# EAGLE design Mood-Badge (EAGLE 9.6.2)
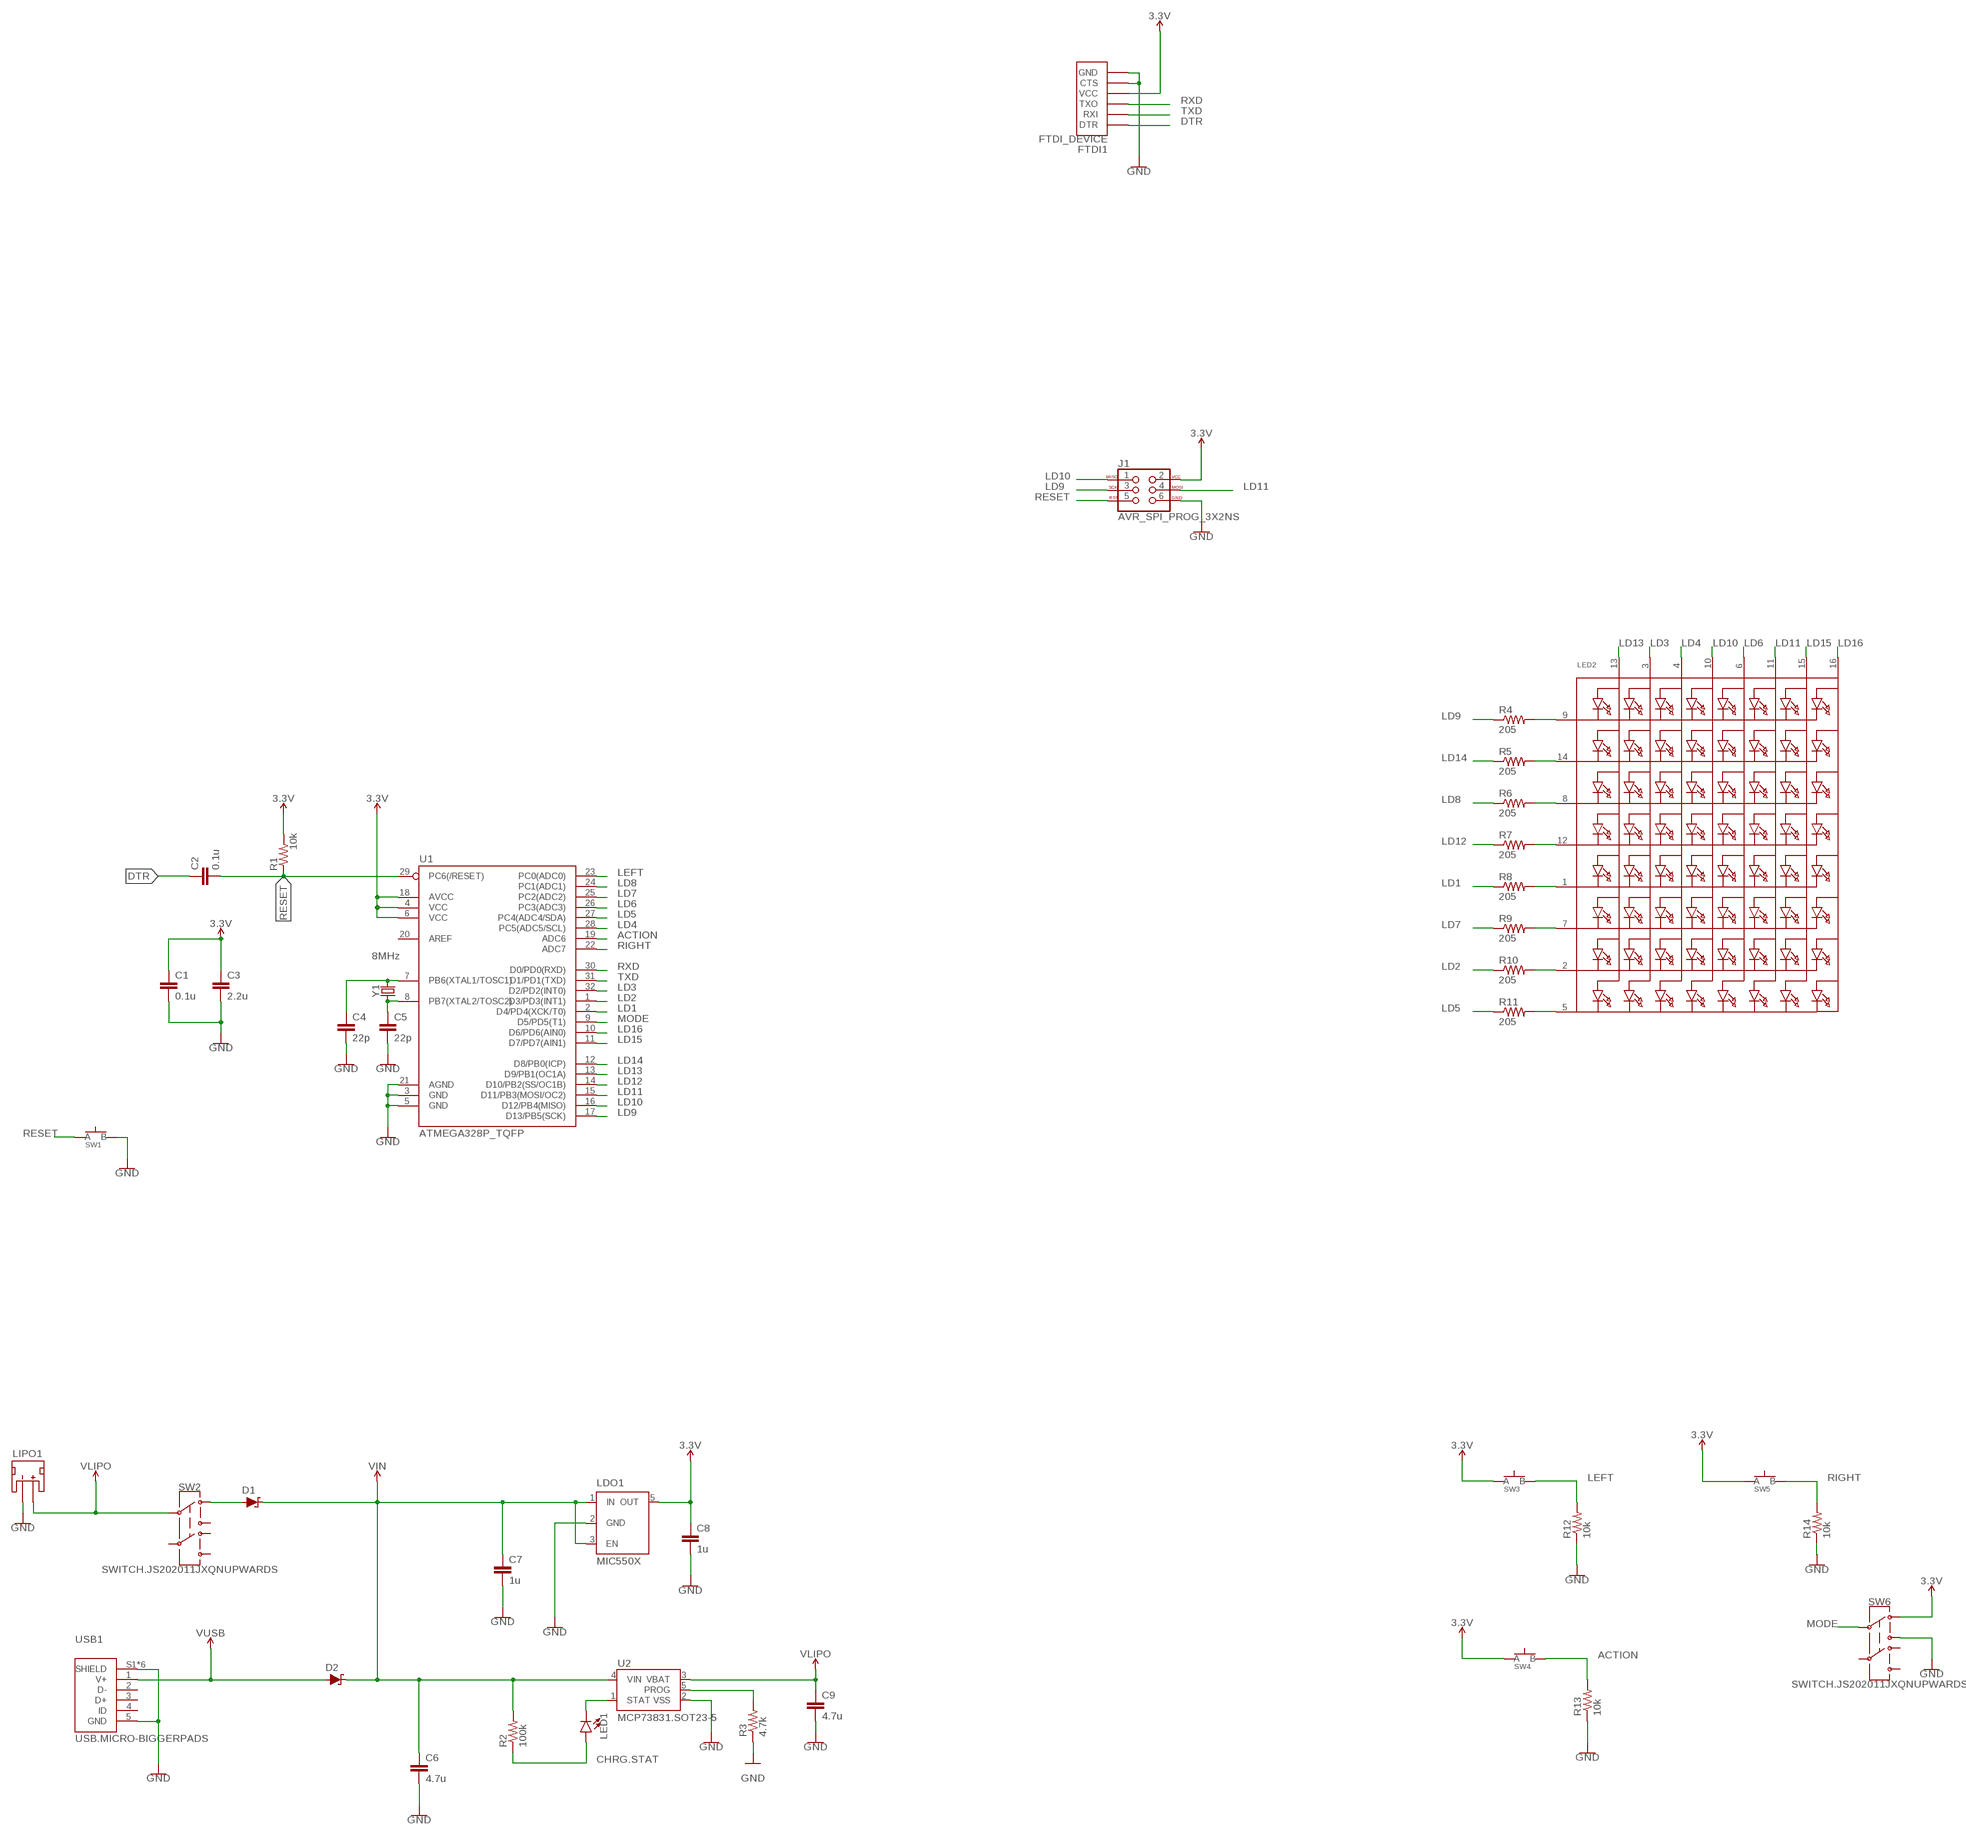
[diagram p0: schematic, sheet 1]

## Parts
C1  0.1u  CAPACITOR0603  [C0603]
C2  0.1u  CAPACITOR0603  [C0603]
C3  2.2u  CAPACITOR0603  [C0603]
C4  22p  CAPACITOR0603  [C0603]
C5  22p  CAPACITOR0603  [C0603]
C6  4.7u  CAPACITOR0603  [C0603]
C7  1u  CAPACITOR0603  [C0603]
C8  1u  CAPACITOR0603  [C0603]
C9  4.7u  CAPACITOR0603  [C0603]
D1  SCHOTTKY-USC  [USC]
D2  SCHOTTKY-USC  [USC]
FTDI1  FTDI_DEVICE  [FTDI_DEVICE]
J1  AVR_SPI_PROG_3X2NS  [2X3-NS]
LDO1  MIC550X  [SOT23-5]
LED1  LED0603  [LED-0603]
LED2  DOTMATRIX_8X8_ROWCATHODEM12A881UR  [DOTMATRIX_BL-M12A881UR]
LIPO1  JST_2MM_MALE  [JST-2-SMD]
R1  10k  RESISTOR0603  [R0603]
R2  100k  RESISTOR0603  [R0603]
R3  4.7k  RESISTOR0603  [R0603]
R4  205  RESISTOR0603  [R0603]
R5  205  RESISTOR0603  [R0603]
R6  205  RESISTOR0603  [R0603]
R7  205  RESISTOR0603  [R0603]
R8  205  RESISTOR0603  [R0603]
R9  205  RESISTOR0603  [R0603]
R10  205  RESISTOR0603  [R0603]
R11  205  RESISTOR0603  [R0603]
R12  10k  RESISTOR0603  [R0603]
R13  10k  RESISTOR0603  [R0603]
R14  10k  RESISTOR0603  [R0603]
SW1  SPST.KT11P4SM34LFS  [SPST.KT11P4SM34LFS]
SW2  SWITCH.JS202011JXQNUPWARDS  [SWITCH.00]
SW3  SPST.KT11P4SM34LFS  [SPST.KT11P4SM34LFS]
SW4  SPST.KT11P4SM34LFS  [SPST.KT11P4SM34LFS]
SW5  SPST.KT11P4SM34LFS  [SPST.KT11P4SM34LFS]
SW6  SWITCH.JS202011JXQNUPWARDS  [SWITCH.00]
U1  ATMEGA328P_TQFP  [TQFP32-08]
U2  MCP73831.SOT23-5  [SOT23-5]
USB1  USB.MICRO-BIGGERPADS  [USB-MICRO-01.BIGGERPADS]
Y1  8MHz  CRYSTAL-CA-310  [CA-301]

## Nets
3.3V: C1.1 C3.1 C8.1 FTDI1.VCC J1.2 LDO1.5(OUT) R1.2 SW3.1(A) SW3.2(A) SW4.1(A) SW4.2(A) SW5.1(A) SW5.2(A) SW6.1 U1.4(VCC) U1.6(VCC) U1.18(AVCC)
ACTION: R13.2 SW4.3(B) SW4.4(B) U1.19(ADC6)
CHRG.STAT: LED1.A R2.1
DTR: C2.1 FTDI1.DTR
GND: C1.2 C3.2 C4.2 C5.2 C6.2 C7.2 C8.2 C9.2 FTDI1.CTS FTDI1.GND J1.6 LDO1.2(GND) LIPO1.1(-) R3.1 R12.1 R13.1 R14.1 SW1.3(B) SW1.4(B) SW6.3 U1.3(GND) U1.5(GND) U1.21(AGND) U2.2(VSS) USB1.5(GND) USB1.S1(SHIELD) USB1.S2(SHIELD) USB1.S3(SHIELD) USB1.S4(SHIELD) USB1.S5(SHIELD) USB1.S6(SHIELD)
LD1: R8.1 U1.2(D4/PD4(XCK/T0))
LD2: R10.1 U1.1(D3/PD3(INT1))
LD3: LED2.3(A2) U1.32(D2/PD2(INT0))
LD4: LED2.4(A3) U1.28(PC5(ADC5/SCL))
LD5: R11.1 U1.27(PC4(ADC4/SDA))
LD6: LED2.6(A5) U1.26(PC3(ADC3))
LD7: R9.1 U1.25(PC2(ADC2))
LD8: R6.1 U1.24(PC1(ADC1))
LD9: J1.3 R4.1 U1.17(D13/PB5(SCK))
LD10: J1.1 LED2.10(A4) U1.16(D12/PB4(MISO))
LD11: J1.4 LED2.11(A6) U1.15(D11/PB3(MOSI/OC2))
LD12: R7.1 U1.14(D10/PB2(SS/OC1B))
LD13: LED2.13(A1) U1.13(D9/PB1(OC1A))
LD14: R5.1 U1.12(D8/PB0(ICP))
LD15: LED2.15(A7) U1.11(D7/PD7(AIN1))
LD16: LED2.16(A8) U1.10(D6/PD6(AIN0))
LEFT: R12.2 SW3.3(B) SW3.4(B) U1.23(PC0(ADC0))
MODE: SW6.2 U1.9(D5/PD5(T1))
N$3: C4.1 U1.7(PB6(XTAL1/TOSC1)) Y1.2
N$4: C5.1 U1.8(PB7(XTAL2/TOSC2)) Y1.1
N$6: LED1.C U2.1(STAT)
N$37: LED2.2(K7) R10.2
N$38: LED2.5(K8) R11.2
N$39: LED2.7(K6) R9.2
N$40: LED2.1(K5) R8.2
N$41: LED2.12(K4) R7.2
N$42: LED2.8(K3) R6.2
N$43: LED2.14(K2) R5.2
N$44: LED2.9(K1) R4.2
N$60: D1.+(A) SW2.1
N$64: R3.2 U2.5(PROG)
RESET: C2.2 J1.5 R1.1 SW1.1(A) SW1.2(A) U1.29(PC6(/RESET))
RIGHT: R14.2 SW5.3(B) SW5.4(B) U1.22(ADC7)
RXD: FTDI1.RXI(TXO) U1.30(D0/PD0(RXD))
TXD: FTDI1.TXO(RXI) U1.31(D1/PD1(TXD))
V_USB: D2.+(A) USB1.1(V+) ; supply symbol labelled VUSB
VIN: C6.1 C7.1 D1.-(C) D2.-(C) LDO1.1(IN) LDO1.3(EN) R2.2 U2.4(VIN)
VLIPO: C9.1 LIPO1.2(+) SW2.2 U2.3(VBAT)
Unconnected: LIPO1.NC1(PAD1) LIPO1.NC2(PAD2) SW2.3 SW2.5 SW2.6 SW2.7 SW6.5 SW6.6 SW6.7 U1.20(AREF) USB1.2(D-) USB1.3(D+) USB1.4(ID)

## Library data of the parts
C1-C9 = LinnesLab-Passives:CAPACITOR
D1 D2 = LinnesLab-DiscreteSemi:SCHOTTKY: Schottky diode A Schottky diode is a semiconductor diode which has a low forward voltage drop and a very fast switching action. Example: Digi-Key Part Number: RB161MM-20CT-ND
FTDI1 = LinnesLab-Connectors:FTDI_DEVICE
J1 = LinnesLab-Connectors:AVR_SPI_PROG_3X2: AVR ISP 6 Pin This is the reduced ISP connector for AVR programming. Common on Arduino. This footprint will take up less PCB space and can be used with a 10-pin to 6-pin adapter such as SKU: BOB-08508 **Special note about "TEST_POINT" package. The stop mask is on the top side, so if you want your programming test points to be on the bottom of your board, make sure to place this package on the bottom side of the board. This also ensure that the orientation to program from the bottom side will be correct. SparkFun Products: SparkFun ISP Pogo Adapter <https://www.sparkfun.com/products/11591> - NS Tiny AVR Programmer <https://www.sparkfun.com/products/11801> -PTH
LDO1 = LinnesLab-Power:MIC550X: MIC5504 Voltage Regulator Output Voltages: 1.0V to 3.3V Input Voltages: 2.5V to 5.5V Link to Datasheet http://ww1.microchip.com/downloads/en/DeviceDoc/MIC550X.pdf
LED1 = LinnesLab-LED:LED: LED (Generic) Standard schematic elements and footprints for 5mm, 3mm, 1206, and 0603 sized LEDs. Generic LEDs with no color specified. LTST-C190KGKT: arrow indicates cathode
LED2 = LinnesLab-Displays:DOTMATRIX_8X8_ROWCATHODE: 8x8 LED Segment Displays: Row = Cathode 0.7" Red 8X8 Matrix, 1.9mm Round LEDs - BL-M07C881UR 1.2" Red 8x8 Matrix, 3.0mm Round LEDs - BL-M12A881UR 1.2" Red 8x8 Matrix, 3.0mm Square LEDs - BL-M12A883
LIPO1 = LinnesLab-Connectors:JST_2MM_MALE: JST 2MM MALE RA CONNECTOR Two pin, compact surface mount connector. Commonly used as a battery input connection point. We really like the solid locking feeling and high current rating on these small connectors. We use these all the time as battery connectors. Mates to single-cell LiPo batteries. Here is the connector we sell at SparkFun: JST Right Angle Connector - White <https://www.sparkfun.com/products/8612> (PRT-08612) Datasheet <http://www.sparkfun.com/datasheets/Prototyping/Connectors/JST-Horizontal.pdf> It was used on these SparkFun products: SparkFun MOSFET Power Controller <https://www.sparkfun.com/products/11214> (PRT-11214) SparkFun Battery Babysitter - LiPo Battery Manager <https://www.sparkfun.com/products/13777> (PRT-13777) And many, many others that required a lipo battery connection.; PROD_ID: CONN-11443; SF_ID: PRT-08612
R1-R14 = LinnesLab-Passives:RESISTOR
SW1 SW3-SW5 = LinnesLab-Switches:SPST.KT11P4SM34LFS: https://www.ckswitches.com/media/1468/kt.pdf
SW2 SW6 = LinnesLab-Switches:SWITCH.JS202011JXQN: Manufacturer's Part Numer: JS202011JAQN for right angle throw JS202011JCQN for top side throw
U1 = LinnesLab-Microcontrollers:ATMEGA328P_TQFP: Popular 328P in QFP Storefront component: ATmega328 - TQFP <https://www.sparkfun.com/products/13448> (COM-13448) Datasheet <http://www.sparkfun.com/datasheets/Components/SMD/ATMega328.pdf> SparkFun Products SparkFun RedBoard - Programmed with Arduino <https://www.sparkfun.com/products/12757> (DEV-12757) Arduino Pro Mini 328 - 5V/16MHz <https://www.sparkfun.com/products/11113> (DEV-11113) Arduino Pro Mini 328 - 3.3V/8MHz <https://www.sparkfun.com/products/11114> (DEV-11114) SparkFun OpenLog <https://www.sparkfun.com/products/13712> (DEV-13712) SparkFun MicroView - OLED Arduino Module <https://www.sparkfun.com/products/12923> (DEV-12923) SparkFun Digital Sandbox <https://www.sparkfun.com/products/12651> (DEV-12651) SparkFun PicoBoard <https://www.sparkfun.com/products/11888> (WIG-11888) Arduino Fio <https://www.sparkfun.com/products/10116> (DEV-10116) LilyPad Arduino 328 Main Board <https://www.sparkfun.com/products/13342> (DEV-13342) SparkFun RedStick <https://www.sparkfun.com/products/13741> (DEV-13741) LilyPad MP3 <https://www.sparkfun.com/products/11013> (DEV-11013) LilyPad Arduino SimpleSnap <https://www.sparkfun.com/products/10941> (DEV-10941) SparkFun Stepoko <https://www.sparkfun.com/products/13899> (ROB-13899) SparkFun Geiger Counter <https://www.sparkfun.com/products/11345> (SEN-11345) SparkFun EL Sequencer <https://www.sparkfun.com/products/12781> (COM-12781) Arduino Pro 328 - 5V/16MHz <https://www.sparkfun.com/products/10915> (DEV-10915) CryptoCape <https://www.sparkfun.com/products/12773> (DEV-12773) SparkFun IR Thermometer Evaluation Board - MLX90614 <https://www.sparkfun.com/products/10740> (SEN-10740) SparkFun RedBot Mainboard <https://www.sparkfun.com/products/12097> (ROB-12097) Arduino Pro 328 - 3.3V/8MHz <https://www.sparkfun.com/products/10914> (DEV-10914) SparkFun Block for Intel® Edison - Arduino <https://www.sparkfun.com/products/13036> (DEV-13036) SparkFun Simon Says - Surface Mount Soldering Kit <https://www.sparkfun.com/products/10935> (KIT-10935) SparkFun 7-Segment Serial Display - Red <https://www.sparkfun.com/products/11441> (COM-11441) SparkFun 7-Segment Serial Display - White <https://www.sparkfun.com/products/11629> (COM-11629) SparkFun 7-Segment Serial Display - Yellow <https://www.sparkfun.com/products/11443> (COM-11443) SparkFun 7-Segment Serial Display - Kelly Green <https://www.sparkfun.com/products/11440> (COM-11440) SparkFun 7-Segment Serial Display - Blue <https://www.sparkfun.com/products/11442> (COM-11442) SparkFun OpenSegment Serial Display - 20mm (Blue) <https://www.sparkfun.com/products/11647> (COM-11647) SparkFun OpenSegment Serial Display - 20mm (Green) <https://www.sparkfun.com/products/11646> (COM-11646) SparkFun OpenSegment Serial Display - 20mm (White) <https://www.sparkfun.com/products/11648> (COM-11648) SparkFun OpenSegment Serial Display - 20mm (Red) <https://www.sparkfun.com/products/11644> (COM-11644) SparkFun OpenSegment Serial Display - 20mm (Yellow) <https://www.sparkfun.com/products/11645> (COM-11645) SparkFun OpenSegment Shield <https://www.sparkfun.com/products/13190> (DEV-13190); PROD_ID: IC-09069
U2 = LinnesLab-Power:MCP73831
USB1 = LinnesLab-Connectors:USB.MICRO: DigiKey PN: 609-4613-1-ND
Y1 = LinnesLab-Clocks:CRYSTAL-CA-310

## Board
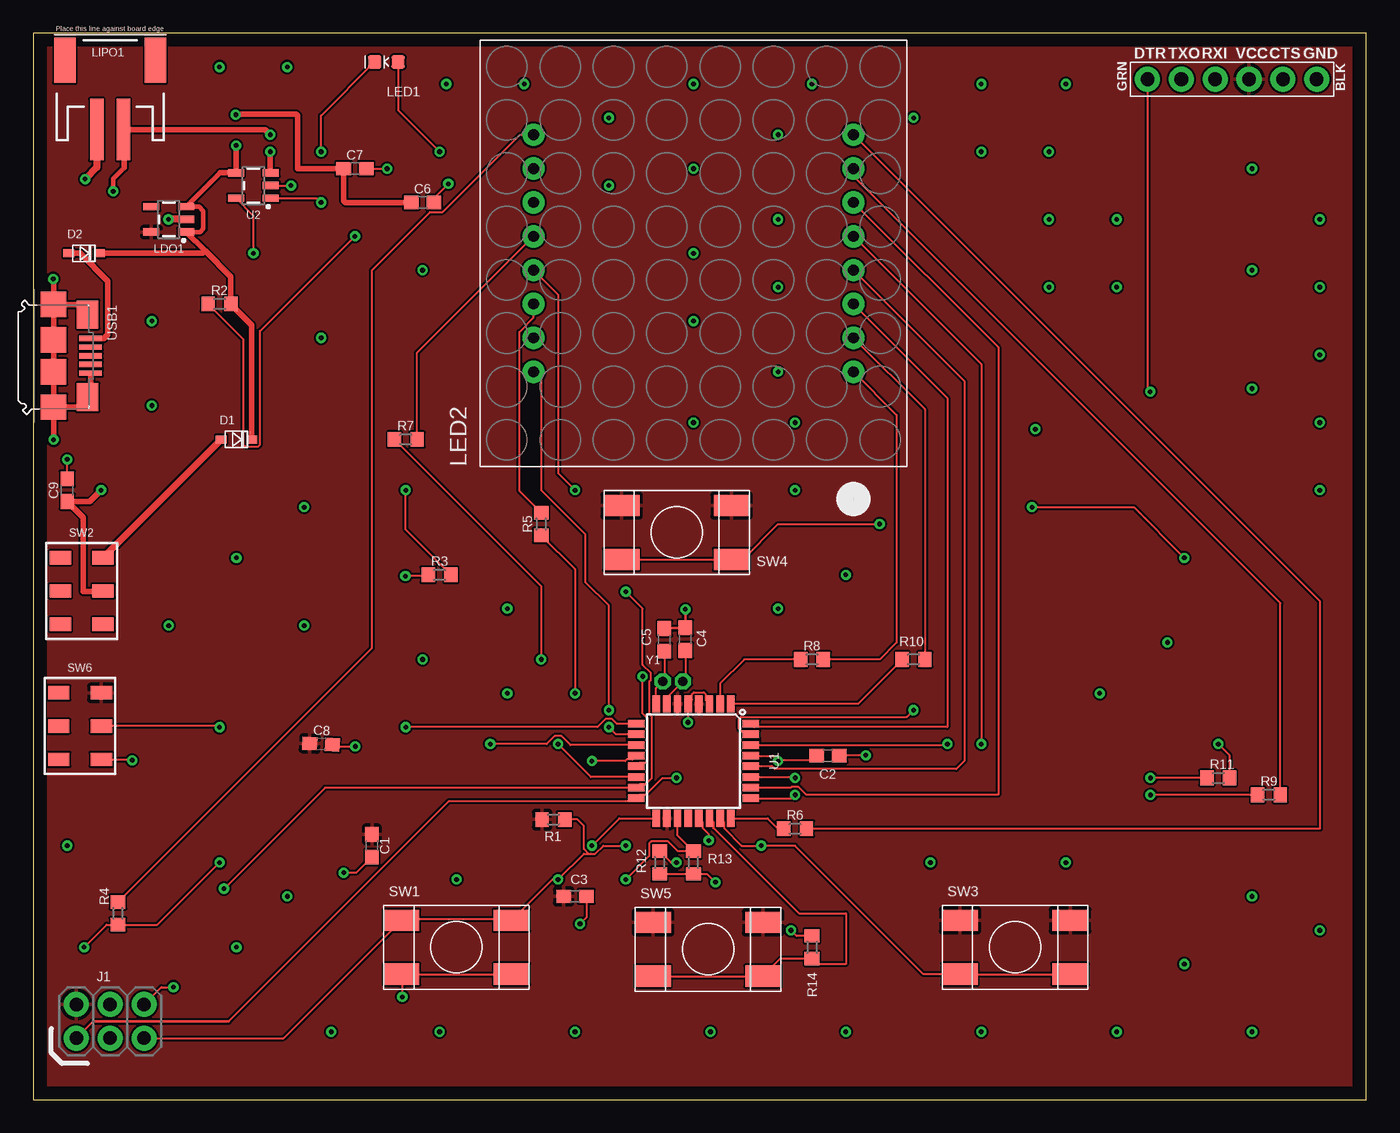
[diagram p1: board, top side]
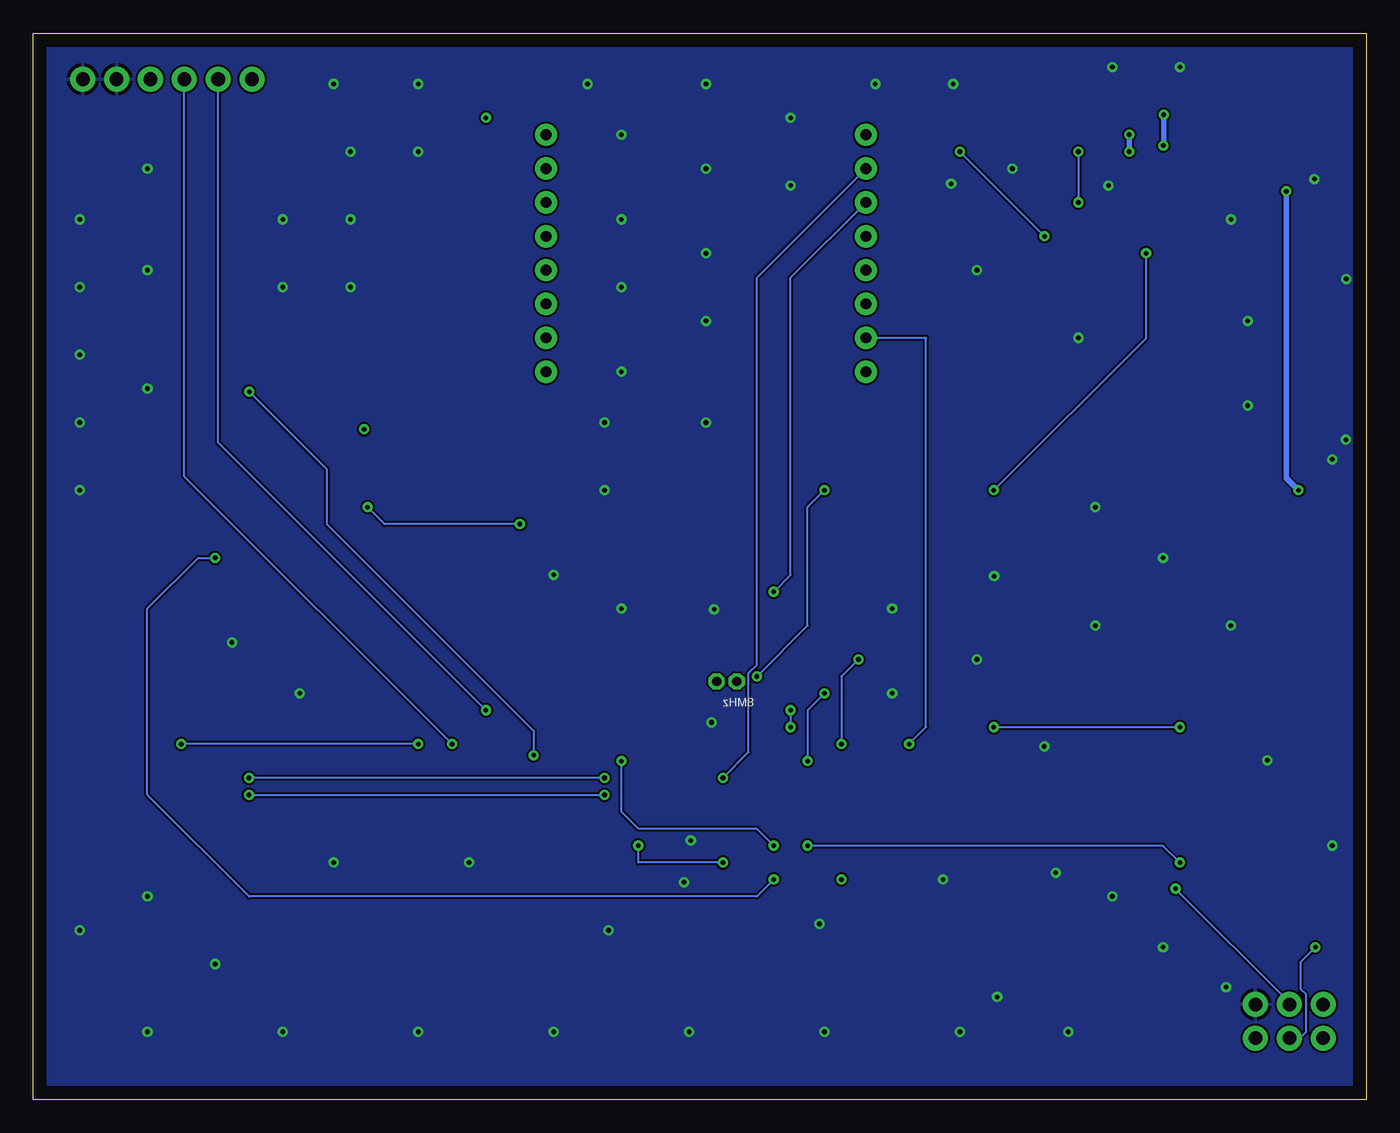
[diagram p2: board, bottom side, seen from below]

Size 100 x 80 mm. Coordinates in mm from the lower left corner, seen from the top.
Outline: 0,0 100,0 100,80 0,80 0,0
Copper layers (1*16): Top 0.035mm / dielectric 1.5mm / Bottom 0.035mm
Design rules "default": minimum track width 6mil, minimum drill 0.35mm, track to track 6mil, track to pad 6mil, pad to pad 6mil, via to via 6mil, smd to smd 6mil, copper to edge 40mil, drill to drill 6mil, minimum pad ring 10mil, minimum via ring 8mil, stop-mask expansion 4mil, vias tented up to drill 0mil, thermal gap 10mil

### Footprints (pad centres in the part's own frame; a part is rotated, then mirrored left to right if it is on the bottom)
C0603 = smd 1.1 x 1: 1 -0.85,0; 2 0.85,0
USC = smd 0.8 x 0.6: + -1.15,0; - 1.15,0
FTDI_DEVICE = drill 1.016 pad 1.88: CTS 3.81,0; DTR -6.35,0; GND 6.35,0; RXI -1.27,0; TXO -3.81,0; VCC 1.27,0
2X3-NS = drill 1.016 pad 1.88: 1 -2.54,-1.27; 2 -2.54,1.27; 3 0,-1.27; 4 0,1.27; 5 2.54,-1.27; 6 2.54,1.27
SOT23-5 = smd 0.55 x 1.2: 1 -0.95,-1.3; 2 0,-1.3; 3 0.95,-1.3; 4 0.95,1.3; 5 -0.95,1.3
LED-0603 = smd 1 x 1: A -0.877,0; C 0.877,0
DOTMATRIX_BL-M12A881UR = drill 0.8 pad 1.676: 1 -8.89,-12; 2 -6.35,-12; 3 -3.81,-12; 4 -1.27,-12; 5 1.27,-12; 6 3.81,-12; 7 6.35,-12; 8 8.89,-12; 9 8.89,12; 10 6.35,12; 11 3.81,12; 12 1.27,12; 13 -1.27,12; 14 -3.81,12; 15 -6.35,12; 16 -8.89,12
JST-2-SMD = smd 1 x 4.6: 1 -1,-3.7; 2 1,-3.7 | smd 1.6 x 3.4: NC1 -3.4,1.5; NC2 3.4,1.5
R0603 = smd 1 x 1.1: 1 -0.85,0; 2 0.85,0
SPST.KT11P4SM34LFS = smd 2.665 x 1.59: 1 -4.128,2.02; 2 4.128,2.02; 3 -4.128,-2.02; 4 4.128,-2.02
SWITCH.00 = smd 1 x 1.6: 1 -2.5,1.6; 2 0,1.6; 3 2.5,1.6; 5 -2.5,-1.6; 6 0,-1.6; 7 2.5,-1.6
TQFP32-08 = smd 1.27 x 0.559: 1 -4.293,2.8; 2 -4.293,2; 3 -4.293,1.2; 4 -4.293,0.4; 5 -4.293,-0.4; 6 -4.293,-1.2; 7 -4.293,-2; 8 -4.293,-2.8; 17 4.293,-2.8; 18 4.293,-2; 19 4.293,-1.2; 20 4.293,-0.4; 21 4.293,0.4; 22 4.293,1.2; 23 4.293,2; 24 4.293,2.8 | smd 0.559 x 1.27: 9 -2.8,-4.293; 10 -2,-4.293; 11 -1.2,-4.293; 12 -0.4,-4.293; 13 0.4,-4.293; 14 1.2,-4.293; 15 2,-4.293; 16 2.8,-4.293; 25 2.8,4.293; 26 2,4.293; 27 1.2,4.293; 28 0.4,4.293; 29 -0.4,4.293; 30 -1.2,4.293; 31 -2,4.293; 32 -2.8,4.293
USB-MICRO-01.BIGGERPADS = smd 0.4 x 1.7: 1 -1.3,1.505; 2 -0.65,1.505; 3 0,1.505; 4 0.65,1.505; 5 1.3,1.505 | smd 1.9 x 1.9: S1 -3.85,-1.27; S2 -1.2,-1.27; S3 1.2,-1.27; S4 3.85,-1.27 | smd 2.1 x 1.6: S5 -3.1,1.28; S6 3.1,1.28
CA-301 = drill 0.711 octagon: 1 0,0; 2 1.524,0

### Placement (x,y rotation side)
C1  25.4,19.05 270 top
C2  59.61,25.81 180 top
C3  40.64,15.24 0 top
C4  48.92,34.54 90 top
C5  47.35,34.49 90 top
C6  29.21,67.31 0 top
C7  24.13,69.85 0 top
C8  21.59,26.67 357 top
C9  2.54,45.72 90 top
D1  15.24,49.53 0 top
D2  3.81,63.5 0 top
FTDI1  89.94,76.56 0 top
J1  5.77,5.87 0 top
LDO1  10.16,66.04 90 top
LED1  26.49,77.85 180 top
LED2  49.53,63.5 90 top
LIPO1  5.77,76.48 0 top
R1  39.01,21.01 180 top
R2  13.97,59.69 0 top
R3  30.48,39.37 0 top
R4  6.35,13.97 90 top
R5  38.1,43.18 90 top
R6  57.15,20.32 0 top
R7  27.94,49.53 0 top
R8  58.42,33.02 0 top
R9  92.71,22.86 0 top
R10  66.04,33.02 0 top
R11  88.9,24.13 0 top
R12  46.99,17.78 90 top
R13  49.53,17.78 90 top
R14  58.42,11.43 270 top
SW1  31.75,11.43 0 top
SW2  3.63,38.15 270 top
SW3  73.66,11.43 0 top
SW4  48.26,42.55 0 top
SW5  50.62,11.28 0 top
SW6  3.51,28.02 270 top
U1  49.53,25.4 270 top
U2  16.51,68.58 90 top
USB1  2.79,55.8 270 top
Y1  47.22,31.37 0 top

### Tracks (layer width: path | path; a pad name or v marks a point on that pad's centre or on a via)
3.3V
  pour Top: 8.89,83.82 -3.81,83.82 -3.81,-5.08 -1.27,-5.08 104.14,-5.08 104.14,-3.81 104.14,82.55 104.14,83.82
ACTION  (via drill 0.35)
  Top 0.152: U1.19 48.33,19.83 R13.2 48.36,18.63 47.63,19.36 46.34,19.36 46.21,19.23 46.21,18.27 v44.45,16.51 | SW4.3 SW4.4 53.23,40.52 55.88,43.18 v63.5,43.18 | v74.93,44.45 82.55,44.45 v86.36,40.64
  Bottom 0.152: v44.45,16.51 45.72,15.24 83.82,15.24 91.44,22.86 91.44,36.83 87.63,40.64 v86.36,40.64 | v63.5,43.18 73.66,43.18 v74.93,44.45
CHRG.STAT  (via drill 0.35)
  Top 0.152: v24.13,64.77 17.02,57.66 17.02,49.13 16.89,49 15.89,49 15.76,49.13 15.76,57.05 R2.1 | LED1.A 27.37,74.23 v30.48,71.12
  Bottom 0.152: v24.13,64.77 v30.48,71.12
DTR  (via drill 0.35)
  Top 0.152: v83.8,53.11 83.59,53.31 FTDI1.DTR | v62.46,25.83 62.43,25.81 C2.1
  Bottom 0.152: v83.8,53.11 77.98,47.3 77.98,43.18 62.46,27.66 v62.46,25.83
GND  (via drill 0.35)
  Top 0.152: SW6.3 7.35,25.52 v7.42,25.45 | J1.6 9.6,8.43 v10.52,8.43 10.54,8.43 | C8.2 22.57,26.49 v24.16,26.49 | C1.2 24.22,17.02 v23.29,17.02 23.27,17.02 | SW1.4 SW1.3 27.69,9.35 v27.69,7.7 | C3.2 41.49,13.65 v41.02,13.18 | R12.1 R13.1 50.56,16.93 v51.18,16.31 | R14.1 57.27,12.28 v56.84,12.7 | R3.1 29.53,39.27 v27.91,39.27 27.89,39.27 | USB1.S6 4.04,52.67 3.32,51.95 | 1.52,61.54 v1.5,61.57 | C9.2 v2.54,48.03 2.54,48.06 | U2.2 v19.33,68.58 | C7.2 v26.54,69.85 26.57,69.85 | C6.2 30.06,67.63 v31.14,68.71 | U1.21 50.22,20.82 50.22,20.38 50.67,19.93 v50.67,19.43 50.67,19.38 | U1.3 50.44,29.98 50.44,30.42 50.3,30.56 49.56,30.56 49.42,30.42 49.42,29.98 U1.5 v49.13,28.3 v49.12,28.3
  Top 0.203: C5.2 47.4,35.39 C4.2 v48.92,36.78
  Top 0.406: USB1.S4 USB1.S3 USB1.S2 USB1.S1 | 3.32,51.95 USB1.S4 | USB1.S1 3.32,59.65 USB1.S5 | USB1.S1 1.52,61.54 | USB1.S4 v1.52,49.51 | USB1.5 4.3,52.93 4.04,52.67
  Top 0.508: LIPO1.1 4.77,69.94 v3.89,69.06 | LDO1.2 v10.13,66.04
  other vias: 2.54,19.05 30.48,5.08 40.64,5.08 50.8,5.08 60.96,5.08 71.12,5.08 81.28,5.08 91.44,5.08 96.52,12.7 91.44,15.24 86.36,10.16 77.47,17.78 67.31,17.78 80.01,30.48 85.09,34.29 96.52,45.72 96.52,50.8 96.52,55.88 96.52,60.96 96.52,66.04 91.44,69.85 91.44,62.23 91.44,53.34 81.28,60.96 81.28,66.04 76.2,60.96 76.2,66.04 76.2,71.12 77.47,76.2 71.12,76.2 71.12,71.12 19.05,77.47 13.97,77.47 21.59,57.15 29.21,62.23 8.89,58.42 8.89,52.07 20.32,44.45 15.24,40.64 10.16,35.56 20.32,35.56 57.15,50.8 55.88,54.61 49.53,50.8 49.53,58.42 49.53,63.5 55.88,60.96 55.88,66.04 55.88,72.39 58.42,76.2 49.53,76.2 49.53,69.85 43.18,68.58 43.18,73.66 36.83,76.2 35.56,36.83 29.21,33.02 55.88,36.83 60.96,39.37 57.15,45.72 31.75,16.51 19.05,15.24 15.24,11.43 35.56,30.48 30.99,76.2 22.35,5.08
  pour Bottom: 101.6,82.55 -1.27,82.55 -1.27,-2.54 101.6,-2.54
LD1
  Top 0.152: R8.1 53.34,33.02 51.53,31.21 U1.2
LD2
  Top 0.152: R10.1 61.86,29.69 U1.1
LD3
  Top 0.152: LED2.3 68.58,52.64 68.58,27.94 54.08,27.94 U1.32
LD4
  Top 0.152: LED2.4 69.85,53.91 69.85,25.4 69.24,24.79 55.63,24.79 55.42,25 U1.28
LD5  (via drill 0.35)
  Top 0.152: U1.27 57.08,24.2 v57.15,24.13 | R11.1 v83.82,24.13
  Bottom 0.152: v57.15,24.13 v83.82,24.13
LD6
  Top 0.152: LED2.6 72.39,56.45 72.39,22.86 58.01,22.86 57.4,23.47 56.9,23.47 56.83,23.4 U1.26
LD7  (via drill 0.35)
  Top 0.152: U1.25 56.89,22.6 v57.15,22.86 | R9.1 v83.82,22.86
  Bottom 0.152: v83.82,22.86 v57.15,22.86
LD8
  Top 0.152: R6.1 55.88,20.32 55.09,21.11 U1.24
LD9  (via drill 0.35)
  Top 0.152: v13.97,17.78 9.31,13.12 R4.1 5.5,13.12 v3.81,11.43 | v41.91,19.05 43.97,21.11 U1.17
  Bottom 0.152: J1.3 4.98,4.6 4.5,5.08 4.5,7.88 4.93,8.31 4.93,10.31 v3.81,11.43 | v13.97,17.78 15.24,19.05 v41.91,19.05
LD10  (via drill 0.35)
  Top 0.152: 14.66,5.87 31.18,22.4 45.03,22.4 U1.16 45.53,22.89 45.97,22.89 47.2,24.13 v48.26,24.13
  Top 0.203: J1.1 4.5,5.87 14.66,5.87
  Bottom 0.152: v48.26,24.13 46.33,26.06 46.33,32 45.72,32.61 45.72,61.66 LED2.10
LD11  (via drill 0.35)
  Top 0.152: v44.45,38.1 45.72,36.83 45.72,32.61 46.33,32 46.33,31.5 46.22,31.39 46.22,28.88 46.41,28.7 46.41,24.13 45.97,23.69 45.53,23.69 U1.15 21.88,23.4 v14.3,15.82
  Bottom 0.152: v44.45,38.1 43.18,39.37 43.18,61.66 LED2.11 | v14.3,15.82 5.77,7.29 J1.4
LD12  (via drill 0.35)
  Top 0.152: U1.14 41.84,24.2 v39.37,26.67 | R7.1 38.1,38.52 v38.1,33.02
  Bottom 0.152: v38.1,33.02 39.37,31.75 v39.37,26.67
LD13  (via drill 0.35)
  Top 0.152: LED2.13 39.37,60.39 39.37,46.99 v40.64,45.72 | U1.13 45.53,25.29 45.97,25.29 46.1,25.43 46.1,28.57 45.72,28.95 v45.72,31.75
  Bottom 0.152: v45.72,31.75 41.91,35.56 41.91,44.45 v40.64,45.72
LD14  (via drill 0.35)
  Top 0.152: R5.1 40.64,39.79 v40.64,30.48 | U1.12 44.95,25.51 44.51,25.51 44.4,25.4 v41.91,25.4
  Bottom 0.152: v40.64,30.48 41.91,29.21 v41.91,25.4
LD15  (via drill 0.35)
  Top 0.152: U1.11 40.3,26.6 39.62,27.28 39.12,27.28 38.51,26.67 v34.29,26.67
  Bottom 0.152: v34.29,26.67 33.02,27.94 33.02,57.15 LED2.15
LD16  (via drill 0.35)
  Top 0.152: LED2.16 38.1,54.04 38.1,45.72 41.4,42.42 41.4,38.85 43.18,37.07 v43.18,29.21 | U1.10 43.72,27.4 v43.18,27.94
  Bottom 0.152: v43.18,29.21 v43.18,27.94
LEFT  (via drill 0.35)
  Top 0.152: SW3.4 77.79,9.21 77.58,9.41 SW3.3 66.79,9.41 57.15,19.05 v54.61,19.05 53.15,19.05 51.82,20.38 51.82,20.82 U1.23 | R12.2 47.84,17.78 v48.26,17.78
  Bottom 0.152: v48.26,17.78 54.61,17.78 v54.61,19.05
MODE  (via drill 0.35)
  Top 0.152: SW6.2 13.89,28.02 v13.97,27.94 | U1.9 43.78,28.2 43.43,28.55 42.93,28.55 42.32,27.94 v27.94,27.94
  Bottom 0.152: v27.94,27.94 v13.97,27.94
N$1  (via drill 0.35)
  other vias: 66.04,73.66
N$2  (via drill 0.35)
  other vias: 75.18,50.29
N$3
  Top 0.152: U1.7 47.53,30.16 Y1.2 48.92,31.55 C4.1
N$4
  Top 0.152: U1.8 46.73,30.88 Y1.1 47.35,31.5 C5.1
N$6  (via drill 0.35)
  Top 0.152: LED1.C 21.59,73.83 v21.59,71.12 | U2.1 21.27,67.63 v21.59,67.31
  Bottom 0.152: v21.59,71.12 v21.59,67.31
N$37
  Top 0.152: LED2.2 66.89,51.79 R10.2
N$38  (via drill 0.35)
  Top 0.152: LED2.5 71.12,55.18 v71.12,26.67 | R11.2 89.75,25.82 v88.9,26.67
  Bottom 0.152: v71.12,26.67 v88.9,26.67
N$39
  Top 0.152: R9.2 93.56,37.25 61.53,69.28 LED2.7
N$40
  Top 0.152: LED2.1 64.77,51.37 64.77,34.29 63.5,33.02 R8.2
N$41
  Top 0.152: R7.2 28.79,56.03 LED2.12
N$42
  Top 0.152: LED2.8 96.52,37.4 96.52,20.32 R6.2
N$43
  Top 0.152: LED2.14 37.53,58.66 36.46,57.59 36.46,45.67 R5.2
N$44
  Top 0.152: R4.2 25.4,33.87 25.4,62.23 29.75,66.58 30.7,66.58 36.51,72.39 LED2.9
N$60
  Top 0.152: D1.+ 14.09,49.51
  Top 0.508: 14.09,49.51 SW2.1
N$64  (via drill 0.35)
  Top 0.152: R3.2 27.94,42.76 v27.94,45.72 | U2.5 16.51,66.33 v16.51,63.5
  Bottom 0.152: v27.94,45.72 16.51,57.15 v16.51,63.5
RESET  (via drill 0.35)
  Top 0.152: J1.5 18.77,4.6 SW1.1 27.72,13.55 35.98,13.55 | SW1.2 35.98,13.55 | 35.98,13.55 38.94,16.51 v39.37,16.51 41.3,18.44 41.66,18.44 | 41.66,18.44 41.3,18.8 41.3,20.55 40.84,21.01 R1.1 | 41.66,18.44 41.81,18.44 42.16,18.44 42.77,19.05 v44.45,19.05 | U1.29 55.48,25.8 55.83,25.45 | 55.83,25.45 v55.88,25.4 | C2.2 58.41,25.45 55.83,25.45
  Bottom 0.152: v44.45,19.05 45.72,20.32 54.61,20.32 55.88,21.59 v55.88,25.4
RIGHT
  Top 0.152: SW5.3 SW5.4 56.07,10.58 R14.2 58.84,10.16 60.96,10.16 60.96,13.97 57.43,13.97 51.02,20.38 51.02,20.82 U1.22
RXD  (via drill 0.35)
  Top 0.152: U1.30 68.51,26.6 v68.58,26.67
  Bottom 0.152: v68.58,26.67 88.67,46.76 FTDI1.RXI
TXD  (via drill 0.35)
  Top 0.152: v66.04,29.21 65.54,28.71 53.09,28.71 52.96,28.57 52.96,27.83 53.15,27.64 53.59,27.64 U1.31
  Bottom 0.152: v66.04,29.21 86.13,49.3 FTDI1.TXO
V_USB
  Top 0.406: USB1.1 5.29,57.1 5.59,57.4 5.59,61.42 3.5,63.5 D2.+
VIN  (via drill 0.35)
  Top 0.152: 12.7,63.5 12.88,63.67
  Top 0.356: LDO1.1 12.51,65.09 12.75,65.33 12.75,66.67 12.44,66.99 LDO1.3 14,69.53
  Top 0.406: D1.- 16.39,58.12 R2.2 14.82,61.73 12.88,63.67 LDO1.1 | 14,69.53 U2.4 v15.21,71.57 v15.21,71.58 | D2.- 12.7,63.5 | v15.19,73.89 15.21,73.91 19.74,73.91 19.84,73.81 19.84,69.85 C7.1 23.28,67.45 23.42,67.31 C6.1
  Bottom 0.406: v15.21,71.58 15.19,71.6 v15.19,73.89
VLIPO  (via drill 0.35)
  Top 0.152: U2.3 17.78,69.56 | 6.81,72.74 LIPO1.2 | 3.73,43.68 3.76,43.65 | 5.21,38.12 SW2.2
  Top 0.356: v5.99,68.15 5.99,69.09 6.81,69.9
  Top 0.406: LIPO1.2 17.39,72.78 v17.78,72.39 | 17.78,69.56 v17.78,71.12 | v5.08,45.72 4.23,44.87 C9.1 3.73,43.68 | 6.81,69.9 6.81,72.74 | 3.76,43.65 3.76,38.12 5.21,38.12
  Bottom 0.406: v17.78,72.39 v17.78,71.12 | v5.99,68.15 5.99,46.63 v5.08,45.72